# Altium schematic sheet 17. SOC MCU & MAIN GEN IO, OSC.SchDoc: SOC - MCU GENERAL & MAIN GENERAL (part 1 of 2)
size 513 x 386 mm; Project: PROC154E2(001)_SK_AM69; Issue: 1.0; RevCode: E3; Page Create Date: March  8, 1995; Variant Name: Core Design; Schematic Page Number: 17; Page Number: 17; Page Size: C; Comment: MISTRAL_TITLEBLK_CSIZE_1; Page Count: 62; Schematic Page Count: 62; Name: PROC154E2 001 SK AM69; DsnPath: C:\Users\danie\Downloads\sprr466c\PROC154E3_RP\PROC154E3_SCH.DSN; SchematicName: SCHEMATIC1; PageName: 17. SOC MCU & MAIN GEN IO, OSC; PageSize: C; TopSchematic: True
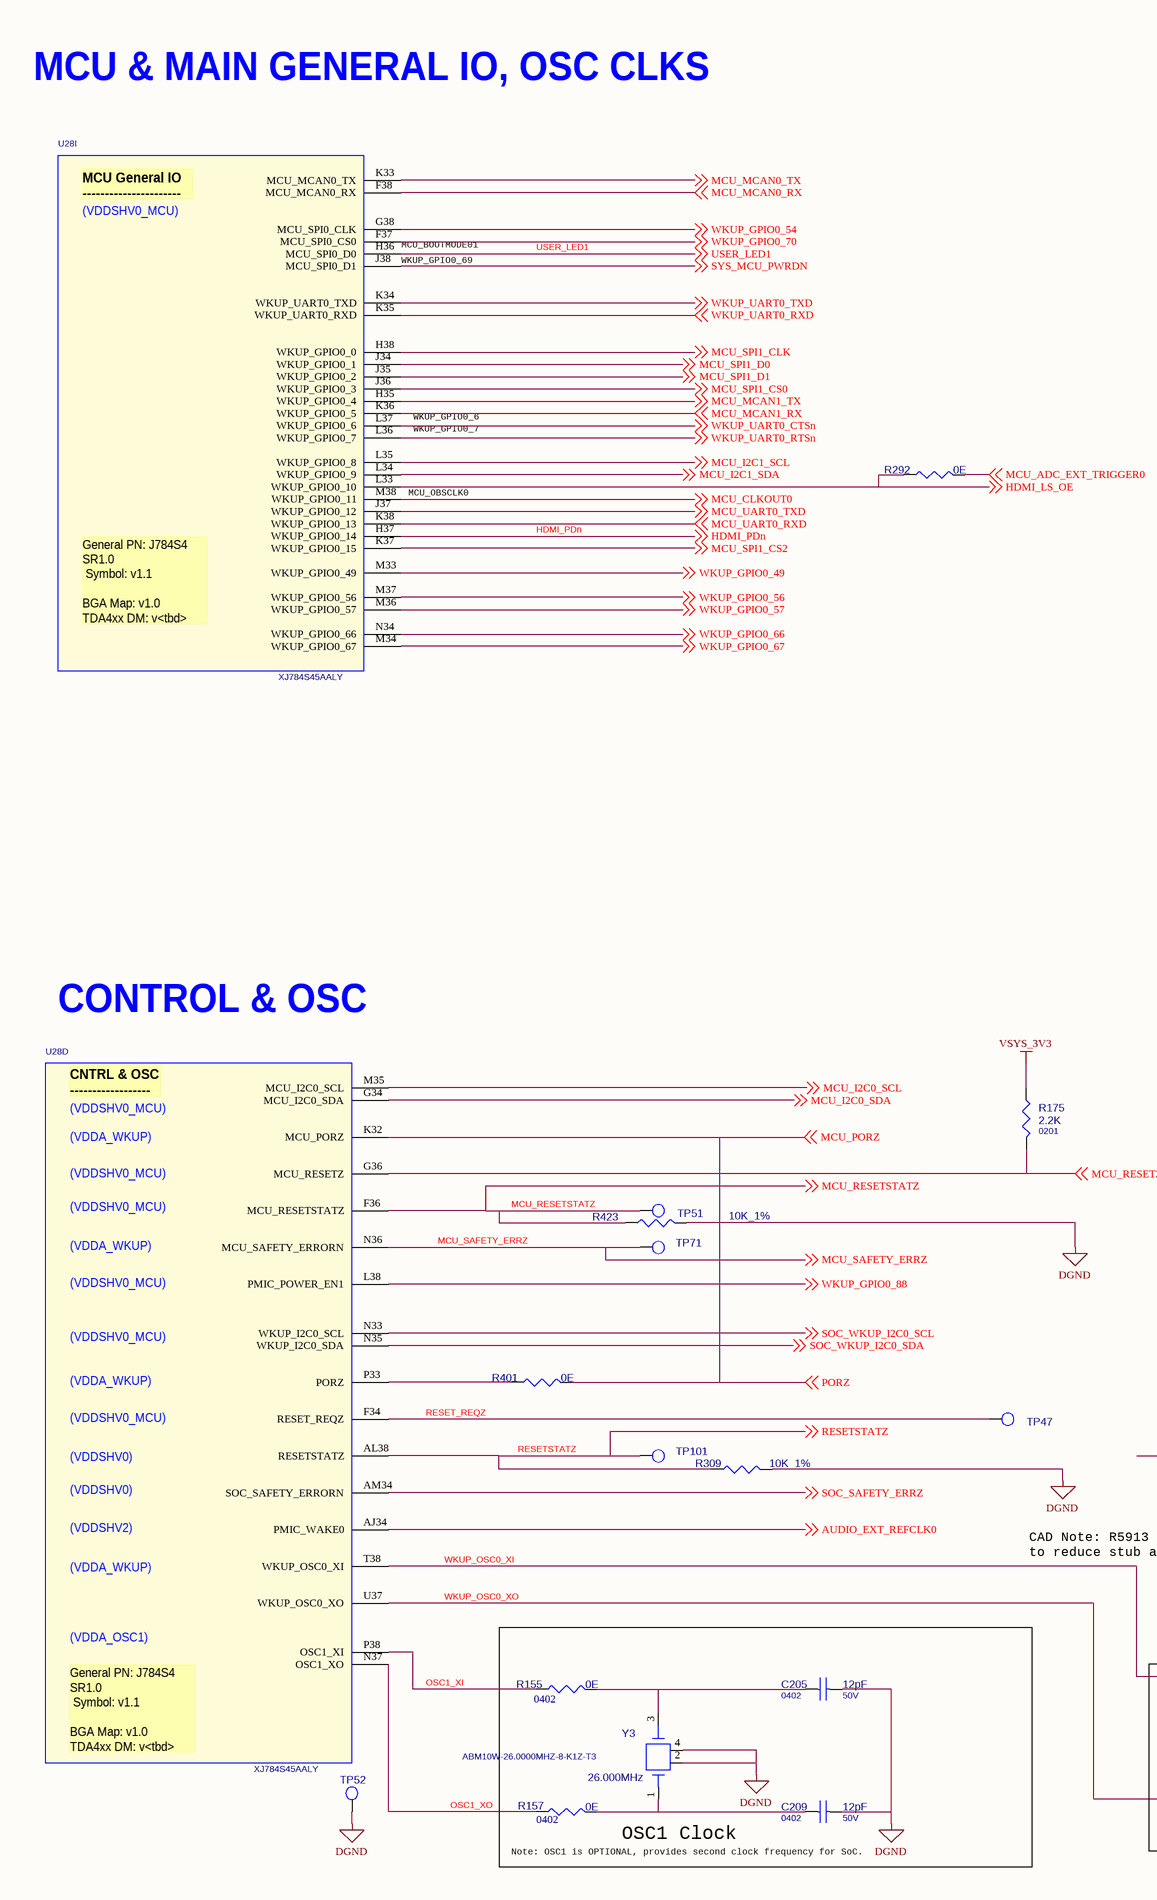
[diagram p0: 17. SOC MCU & MAIN GEN IO, OSC.SchDoc, left]
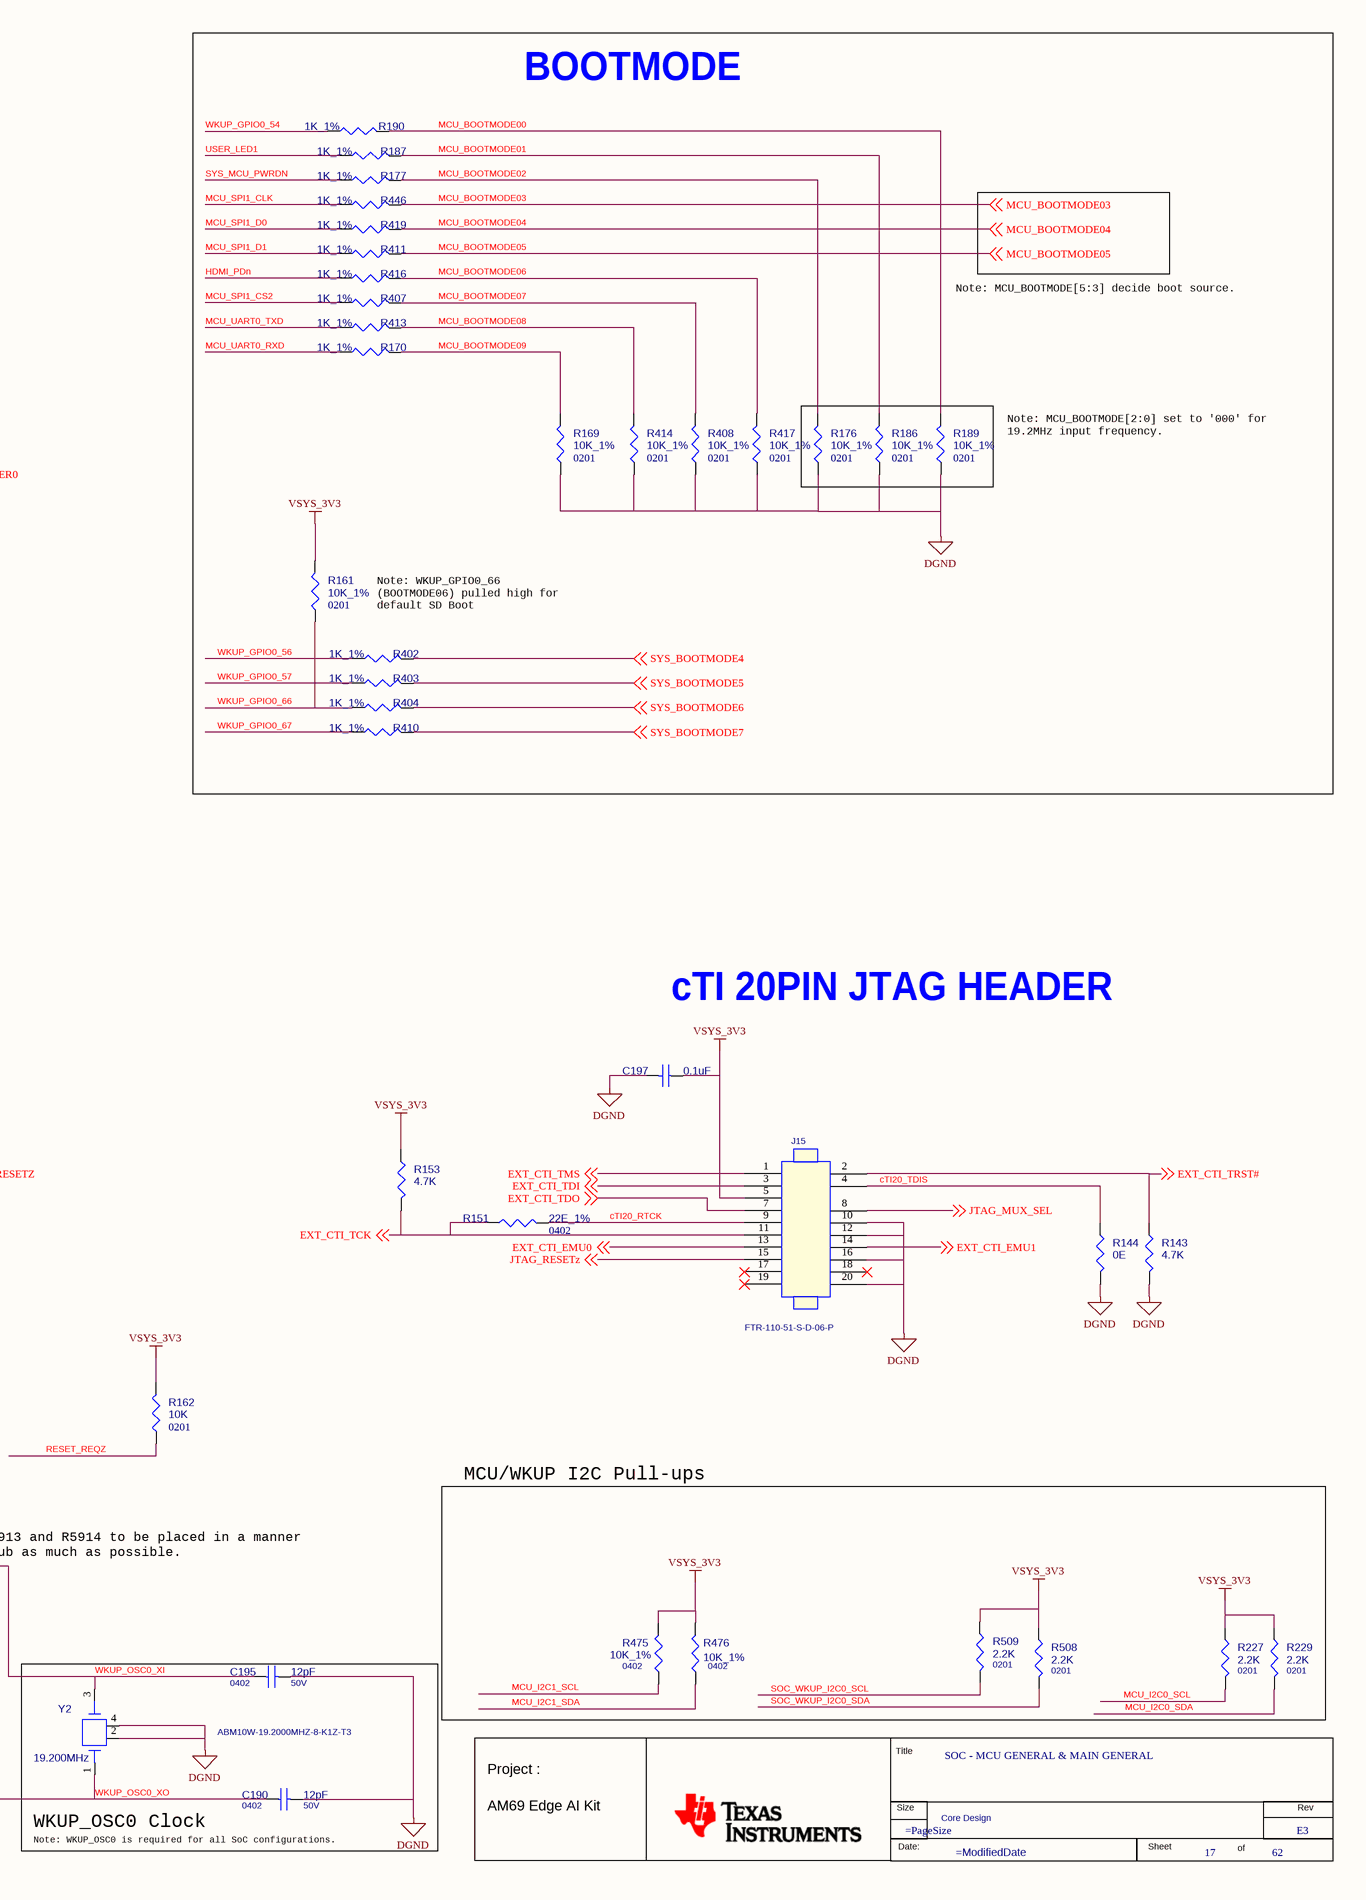
[diagram p1: 17. SOC MCU & MAIN GEN IO, OSC.SchDoc, right]

## Parts
*  RevCode: E3  Title: SOC - MCU GENERAL & MAIN GENERAL  Page Number: 17  Page Count: 62  Variant Name: Core Design  (hidden comment: MISTRAL_TITLEBLK_CSIZE_1)  (graphical)
C190  12pF  Voltage: 50V  Package: 0402  [CAP0402_0-75]
C195  12pF  Voltage: 50V  Package: 0402  [CAP0402_0-75]
C197  0.1uF  [CAP0201_0-5]
C205  12pF  Package: 0402  Voltage: 50V  [CAP0402_0-75]
C209  12pF  Voltage: 50V  Package: 0402  [CAP0402_0-75]
J15  Mfr_part_number: FTR-110-51-S-D-06-P  [HDR_2X10_FTR-110-51-D-06_S_S_8-7]  (hidden comment: HDR_2X10)
R143  4.7K  [RES0201_0-5]
R144  0E  [RES0402_0-5]
R151  22E_1%  Package: 0402  [RES0402_0-5]
R153  4.7K  [RES0201_0-5]
R155  0E  Package: 0402  [RES0402_0-5]
R157  0E  Package: 0402  [RES0402_0-5]
R161  10K_1%  Package: 0201  [RES0201_0-5]
R162  10K  Package: 0201  [RES0201_0-5]
R169  10K_1%  Package: 0201  [RES0201_0-5]
R170  1K_1%  [RES0201_0-5]
R175  2.2K  Package: 0201  [RES0201_0-5]
R176  10K_1%  Package: 0201  [RES0201_0-5]
R177  1K_1%  [RES0201_0-5]
R186  10K_1%  Package: 0201  [RES0201_0-5]
R187  1K_1%  [RES0201_0-5]
R189  10K_1%  Package: 0201  [RES0201_0-5]
R190  1K_1%  [RES0201_0-5]
R227  2.2K  Package: 0201  [RES0201_0-5]
R229  2.2K  Package: 0201  [RES0201_0-5]
R292  0E  [RES0402_0-5]
R309  10K_1%  [RES0402_0-5]
R401  0E  [RES0402_0-5]
R402  1K_1%  [RES0201_0-5]
R403  1K_1%  [RES0201_0-5]
R404  1K_1%  [RES0201_0-5]
R407  1K_1%  [RES0201_0-5]
R408  10K_1%  Package: 0201  [RES0201_0-5]
R410  1K_1%  [RES0201_0-5]
R411  1K_1%  [RES0201_0-5]
R413  1K_1%  [RES0201_0-5]
R414  10K_1%  Package: 0201  [RES0201_0-5]
R416  1K_1%  [RES0201_0-5]
R417  10K_1%  Package: 0201  [RES0201_0-5]
R419  1K_1%  [RES0201_0-5]
R423  10K_1%  [RES0402_0-5]
R446  1K_1%  [RES0201_0-5]
R475  10K_1%  Package: 0402  [RES0402_0-5]
R476  10K_1%  Package: 0402  [RES0402_0-5]
R508  2.2K  Package: 0201  [RES0201_0-5]
R509  2.2K  Package: 0201  [RES0201_0-5]
TP47  TP30_SMD  [TP30_SMD]  (value not drawn)
TP51  TP30_SMD  [TP30_SMD]  (value not drawn)
TP52  TP30_SMD  [TP30_SMD]  (value not drawn)
TP71  TP30_SMD  [TP30_SMD]  (value not drawn)
TP101  TP30_SMD  [TP30_SMD]  (value not drawn)
U28  XJ784S45AALY  [BGA1414_31-49_1230X1230_2-7]  (parts D,I of 26)
Y2  19.200MHz  Mfr_part_number: ABM10W-19.2000MHZ-8-K1Z-T3  [XTAL4_ABM10W_100X80_SMD_0-6]
Y3  26.000MHz  Mfr_part_number: ABM10W-26.0000MHZ-8-K1Z-T3  [XTAL4_ABM10W_100X80_SMD_0-6]

## Blocks framed on the sheet
BOOTMODE: R161 R169 R170 R176 R177 R186 R187 R189 R190 R402-R404 R407 R408 R410 R411 R413 R414 R416 R417 R419 R446
MCU/WKUP I2C Pull-ups: R227 R229 R475 R476 R508 R509
OSC1 Clock: C205 C209 R155 R157 Y3
WKUP_OSC0 Clock: C190 C195 Y2

## Nets
DGND: C190.2 C195.2 C197.2 C205.2 C209.2 J15.10 J15.12 J15.16 J15.20 R143.2 R144.2 R169.1 R176.1 R186.1 R189.1 R309.2 R408.1 R414.1 R417.1 R423.2 TP52.1(TP) Y2.2(GND1) Y2.4(GND2) Y3.2(GND1) Y3.4(GND2)
VSYS_3V3: C197.1 J15.5 R153.1 R161.2 R162.1 R175.1 R227.1 R229.1 R475.2 R476.2 R508.1 R509.1
AUDIO_EXT_REFCLK0: U28.AJ34(PMIC_WAKE0) ; off-sheet AUDIO_EXT_REFCLK0
cTI20_RTCK: J15.9 R151.2
cTI20_TDIS: J15.4 R144.1
EXT_CTI_EMU0: J15.13 ; off-sheet EXT_CTI_EMU0
EXT_CTI_EMU1: J15.14 ; off-sheet EXT_CTI_EMU1
EXT_CTI_TCK: J15.11 R151.1 R153.2 ; off-sheet EXT_CTI_TCK
EXT_CTI_TDI: J15.3 ; off-sheet EXT_CTI_TDI
EXT_CTI_TDO: J15.7 ; off-sheet EXT_CTI_TDO
EXT_CTI_TMS: J15.1 ; off-sheet EXT_CTI_TMS
EXT_CTI_TRST#: J15.2 R143.1 ; off-sheet EXT_CTI_TRST#
HDMI_LS_OE: R292.1 U28.L33(WKUP_GPIO0_10) ; off-sheet HDMI_LS_OE
HDMI_PDn: R416.2 U28.H37(WKUP_GPIO0_14) ; off-sheet HDMI_PDn
JTAG_MUX_SEL: J15.8 ; off-sheet JTAG_MUX_SEL
JTAG_RESETz: J15.15 ; off-sheet JTAG_RESETz
MCU_ADC_EXT_TRIGGER0: R292.2 ; off-sheet MCU_ADC_EXT_TRIGGER0
MCU_BOOTMODE00: R189.2 R190.1
MCU_BOOTMODE01: R186.2 R187.1
MCU_BOOTMODE02: R176.2 R177.1
MCU_BOOTMODE03: R446.1 ; off-sheet MCU_BOOTMODE03
MCU_BOOTMODE04: R419.1 ; off-sheet MCU_BOOTMODE04
MCU_BOOTMODE05: R411.1 ; off-sheet MCU_BOOTMODE05
MCU_BOOTMODE06: R416.1 R417.2
MCU_BOOTMODE07: R407.1 R408.2
MCU_BOOTMODE08: R413.1 R414.2
MCU_BOOTMODE09: R169.2 R170.1
MCU_CLKOUT0: U28.M38(WKUP_GPIO0_11) ; off-sheet MCU_CLKOUT0
MCU_I2C0_SCL: R227.2 U28.M35(MCU_I2C0_SCL) ; off-sheet MCU_I2C0_SCL
MCU_I2C0_SDA: R229.2 U28.G34(MCU_I2C0_SDA) ; off-sheet MCU_I2C0_SDA
MCU_I2C1_SCL: R475.1 U28.L35(WKUP_GPIO0_8) ; off-sheet MCU_I2C1_SCL
MCU_I2C1_SDA: R476.1 U28.L34(WKUP_GPIO0_9) ; off-sheet MCU_I2C1_SDA
MCU_MCAN0_RX: U28.F38(MCU_MCAN0_RX) ; off-sheet MCU_MCAN0_RX
MCU_MCAN0_TX: U28.K33(MCU_MCAN0_TX) ; off-sheet MCU_MCAN0_TX
MCU_MCAN1_RX: U28.K36(WKUP_GPIO0_5) ; off-sheet MCU_MCAN1_RX
MCU_MCAN1_TX: U28.H35(WKUP_GPIO0_4) ; off-sheet MCU_MCAN1_TX
MCU_PORZ: R401.2 U28.K32(MCU_PORZ) ; off-sheet PORZ, off-sheet MCU_PORZ  [also labelled PORZ]
MCU_RESETSTATZ: R423.1 TP51.1(TP) U28.F36(MCU_RESETSTATZ) ; off-sheet MCU_RESETSTATZ
MCU_RESETZ: R175.2 U28.G36(MCU_RESETZ) ; off-sheet MCU_RESETZ
MCU_SAFETY_ERRZ: TP71.1(TP) U28.N36(MCU_SAFETY_ERRORN) ; off-sheet MCU_SAFETY_ERRZ
MCU_SPI1_CLK: R446.2 U28.H38(WKUP_GPIO0_0) ; off-sheet MCU_SPI1_CLK
MCU_SPI1_CS0: U28.J36(WKUP_GPIO0_3) ; off-sheet MCU_SPI1_CS0
MCU_SPI1_CS2: R407.2 U28.K37(WKUP_GPIO0_15) ; off-sheet MCU_SPI1_CS2
MCU_SPI1_D0: R419.2 U28.J34(WKUP_GPIO0_1) ; off-sheet MCU_SPI1_D0
MCU_SPI1_D1: R411.2 U28.J35(WKUP_GPIO0_2) ; off-sheet MCU_SPI1_D1
MCU_UART0_RXD: R170.2 U28.K38(WKUP_GPIO0_13) ; off-sheet MCU_UART0_RXD
MCU_UART0_TXD: R413.2 U28.J37(WKUP_GPIO0_12) ; off-sheet MCU_UART0_TXD
OSC1_XI: R155.1 U28.P38(OSC1_XI)
OSC1_XO: R157.1 U28.N37(OSC1_XO)
RESET_REQZ: R162.2 TP47.1(TP) U28.F34(RESET_REQZ)
RESETSTATZ: R309.1 TP101.1(TP) U28.AL38(RESETSTATZ) ; off-sheet RESETSTATZ
SOC_SAFETY_ERRZ: U28.AM34(SOC_SAFETY_ERRORN) ; off-sheet SOC_SAFETY_ERRZ
SOC_WKUP_I2C0_SCL: R509.2 U28.N33(WKUP_I2C0_SCL) ; off-sheet SOC_WKUP_I2C0_SCL
SOC_WKUP_I2C0_SDA: R508.2 U28.N35(WKUP_I2C0_SDA) ; off-sheet SOC_WKUP_I2C0_SDA
SYS_BOOTMODE4: R402.1 ; off-sheet SYS_BOOTMODE4
SYS_BOOTMODE5: R403.1 ; off-sheet SYS_BOOTMODE5
SYS_BOOTMODE6: R404.1 ; off-sheet SYS_BOOTMODE6
SYS_BOOTMODE7: R410.1 ; off-sheet SYS_BOOTMODE7
SYS_MCU_PWRDN: R177.2 U28.J38(MCU_SPI0_D1) ; off-sheet SYS_MCU_PWRDN
USER_LED1: R187.2 U28.H36(MCU_SPI0_D0) ; off-sheet USER_LED1
WKUP_GPIO0_49: U28.M33(WKUP_GPIO0_49) ; off-sheet WKUP_GPIO0_49
WKUP_GPIO0_54: R190.2 U28.G38(MCU_SPI0_CLK) ; off-sheet WKUP_GPIO0_54
WKUP_GPIO0_56: R402.2 U28.M37(WKUP_GPIO0_56) ; off-sheet WKUP_GPIO0_56
WKUP_GPIO0_57: R403.2 U28.M36(WKUP_GPIO0_57) ; off-sheet WKUP_GPIO0_57
WKUP_GPIO0_66: R161.1 R404.2 U28.N34(WKUP_GPIO0_66) ; off-sheet WKUP_GPIO0_66
WKUP_GPIO0_67: R410.2 U28.M34(WKUP_GPIO0_67) ; off-sheet WKUP_GPIO0_67
WKUP_GPIO0_70: U28.F37(MCU_SPI0_CS0) ; off-sheet WKUP_GPIO0_70
WKUP_GPIO0_88: U28.L38(PMIC_POWER_EN1) ; off-sheet WKUP_GPIO0_88
WKUP_OSC0_XI: C195.1 U28.T38(WKUP_OSC0_XI) Y2.3
WKUP_OSC0_XO: C190.1 U28.U37(WKUP_OSC0_XO) Y2.1
WKUP_UART0_CTSn: U28.L37(WKUP_GPIO0_6) ; off-sheet WKUP_UART0_CTSn
WKUP_UART0_RTSn: U28.L36(WKUP_GPIO0_7) ; off-sheet WKUP_UART0_RTSn
WKUP_UART0_RXD: U28.K35(WKUP_UART0_RXD) ; off-sheet WKUP_UART0_RXD
WKUP_UART0_TXD: U28.K34(WKUP_UART0_TXD) ; off-sheet WKUP_UART0_TXD
NetC205_1: C205.1 R155.2 Y3.3
NetC209_1: C209.1 R157.2 Y3.1
NetR401_1: R401.1 U28.P33(PORZ)

Not connected (* = marked no-connect by the designer): J15 17* 18* 19*

## Notes on the sheet
- MCU & MAIN GENERAL IO, OSC CLKS
- (near U28) WKUP_GPIO0_69
- (near U28) MCU_BOOTMODE01
- Note: MCU_BOOTMODE[5:3] decide boot source.
- WKUP_GPIO0_6
- Note: MCU_BOOTMODE[2:0] set to '000' for
  19.2MHz input frequency.
- WKUP_GPIO0_7
- (near U28) MCU_OBSCLK0
- Note: WKUP_GPIO0_66
  (BOOTMODE06) pulled high for
  default SD Boot
- CONTROL & OSC
- cTI 20PIN JTAG HEADER
- CAD Note: R5913 and R5914 to be placed in a manner
  to reduce stub as much as possible.
- Note: OSC1 is OPTIONAL, provides second clock frequency for SoC.
- (near C190) Note: WKUP_OSC0 is required for all SoC configurations.
- (in symbol J7AHPSoC-EVM_BGA1414, part D) CNTRL & OSC / ------------------; (VDDSHV0_MCU); (VDDA_WKUP); (VDDSHV0); (VDDSHV2); (VDDA_OSC1); General PN: J784S4 / SR1.0 / Symbol: v1.1 / BGA Map: v1.0 / TDA4xx DM: v<tbd>
- (in symbol J7AHPSoC-EVM_BGA1414, part I) MCU General IO / ----------------------; (VDDSHV0_MCU); General PN: J784S4 / SR1.0 / Symbol: v1.1 / BGA Map: v1.0 / TDA4xx DM: v<tbd>
- (in symbol MISTRAL_TITLEBLK_CSIZE_1) Title; Project :; Size; Rev; AM69 Edge AI Kit; Date:; Sheet; of